# EAGLE schematic 7segDisplay (EAGLE 7.6.0)
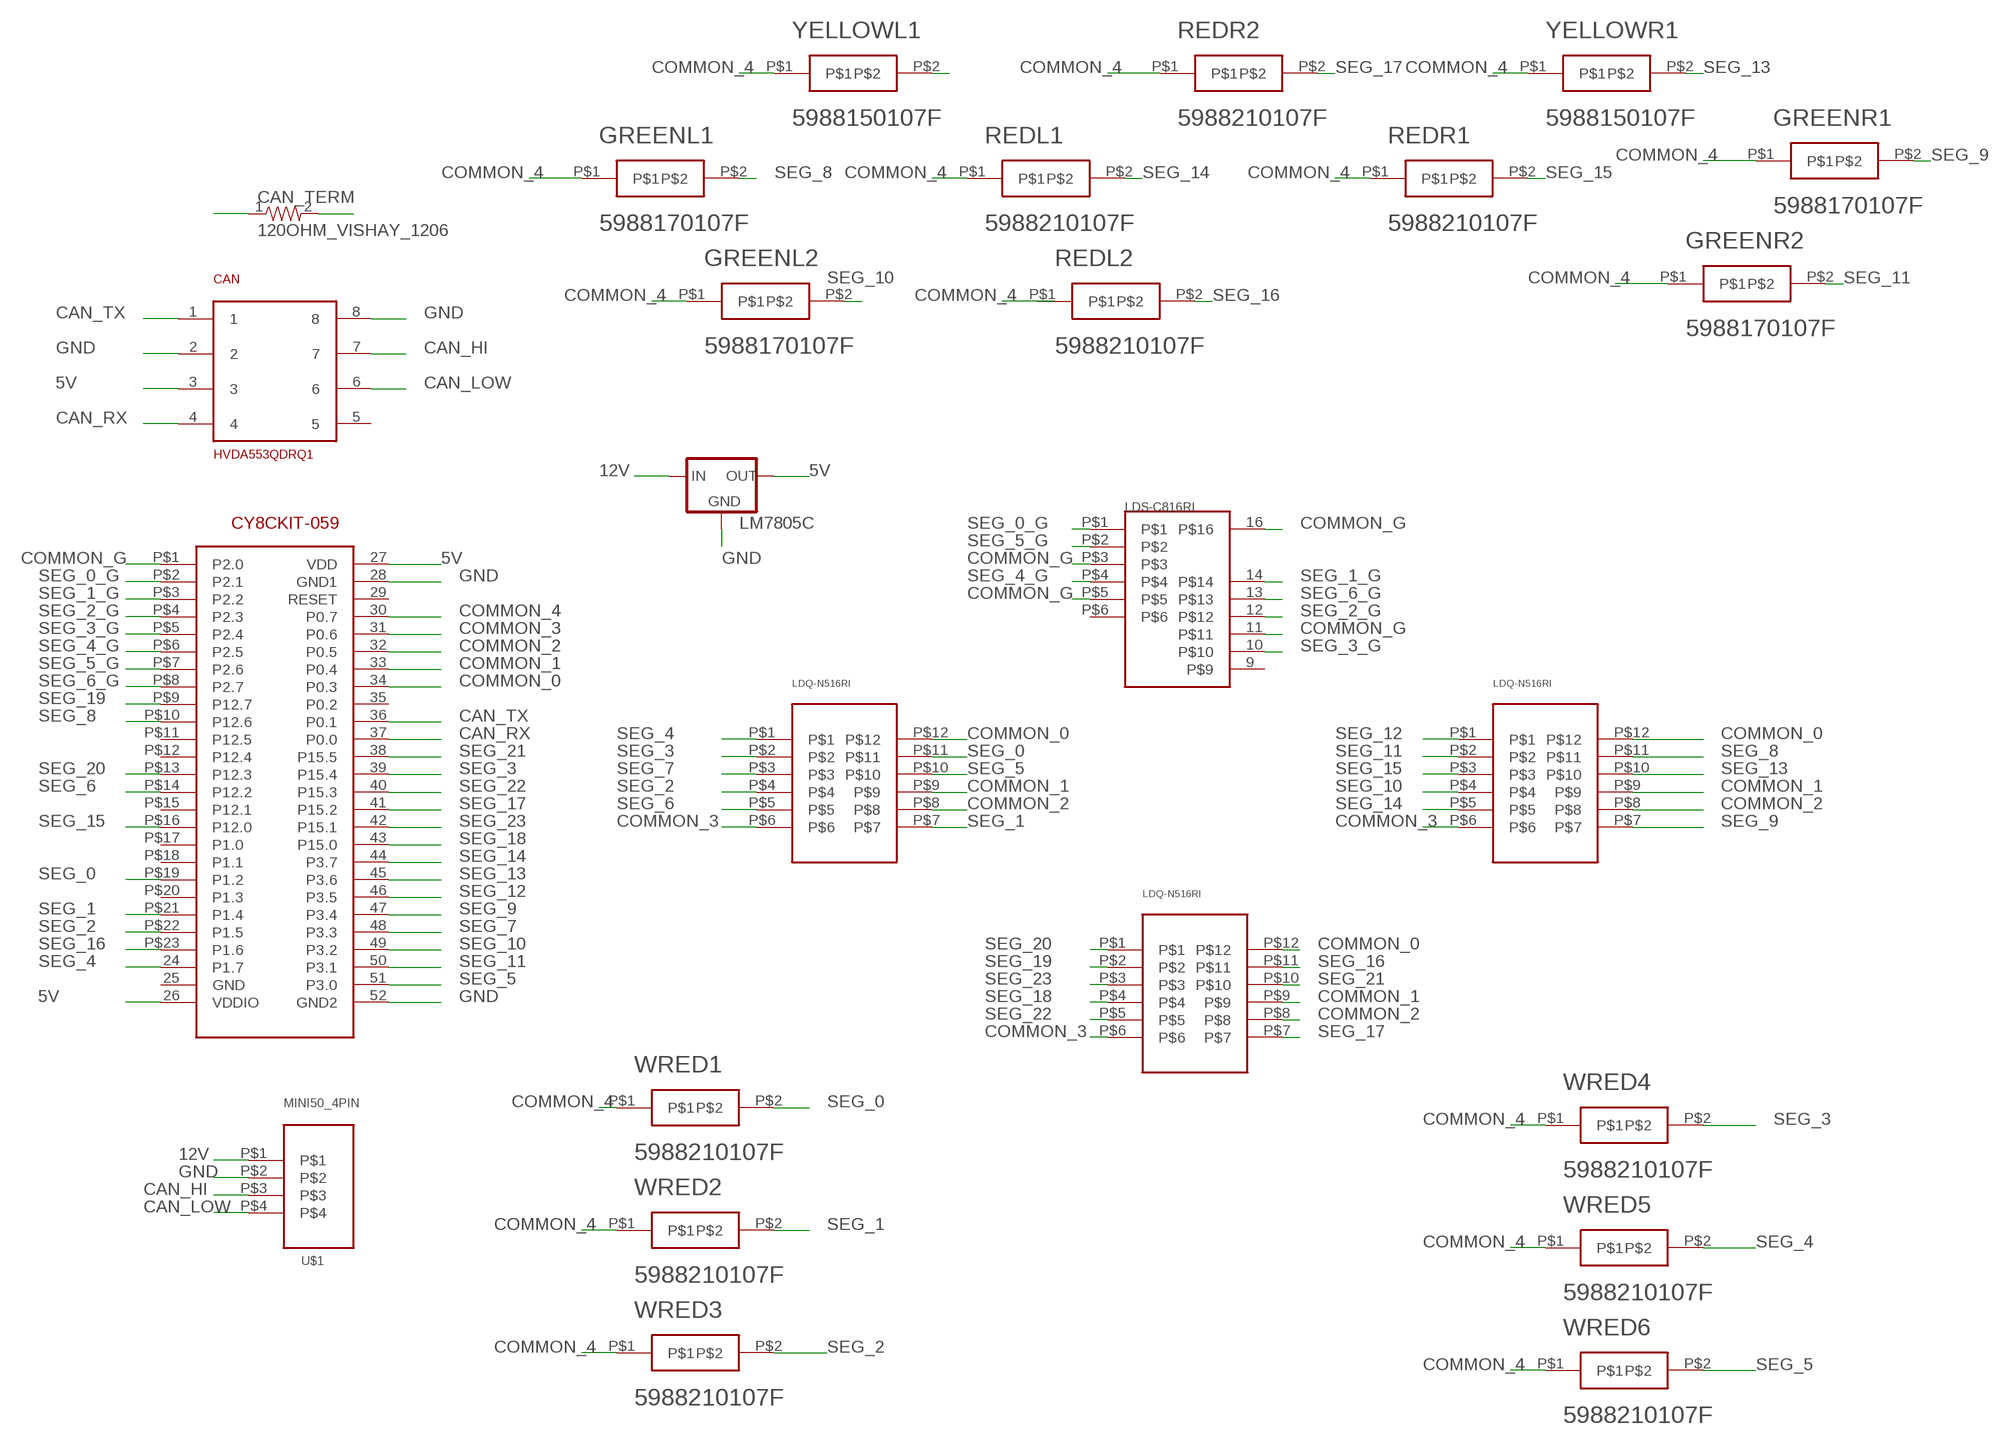
[diagram p0: schematic, sheet 1]

## Parts
BOTTOM  LDQ-N516RI  [LDQ-N516RI]
CAN  HVDA553QDRQ1  [SOIC127P600X172-8N]
CAN_TERM  120OHM_VISHAY_1206  [1206]
GEAR  LDS-C816RITHROUGH_HOLE  [LDS-C816RI]
GREENL1  5988170107F  [0805]
GREENL2  5988170107F  [0805]
GREENR1  5988170107F  [0805]
GREENR2  5988170107F  [0805]
LEFT  LDQ-N516RI  [LDQ-N516RI]
LM7805C  78XXL  [78XXL]
REDL1  5988210107F  [1206]
REDL2  5988210107F  [1206]
REDR1  5988210107F  [1206]
REDR2  5988210107F  [1206]
RIGHT  LDQ-N516RI  [LDQ-N516RI]
U$1  MINI50_4PIN  [34792-0041]
U$3  CY8CKIT-059  [CY8CKIT-059]
WRED1  5988210107F  [1206]
WRED2  5988210107F  [1206]
WRED3  5988210107F  [1206]
WRED4  5988210107F  [1206]
WRED5  5988210107F  [1206]
WRED6  5988210107F  [1206]
YELLOWL1  5988150107F  [0805]
YELLOWR1  5988150107F  [0805]

## Nets
5V: CAN.3 LM7805C.OUT U$3.26(VDDIO) U$3.27(VDD)
12V: LM7805C.IN U$1.P$1
CAN_HI: CAN.7 CAN_TERM.1 U$1.P$3
CAN_LOW: CAN.6 CAN_TERM.2 U$1.P$4
CAN_RX: CAN.4 U$3.37(P0.0)
CAN_TX: CAN.1 U$3.36(P0.1)
COMMON_0: BOTTOM.P$12 LEFT.P$12 RIGHT.P$12 U$3.34(P0.3)
COMMON_1: BOTTOM.P$9 LEFT.P$9 RIGHT.P$9 U$3.33(P0.4)
COMMON_2: BOTTOM.P$8 LEFT.P$8 RIGHT.P$8 U$3.32(P0.5)
COMMON_3: BOTTOM.P$6 LEFT.P$6 RIGHT.P$6 U$3.31(P0.6)
COMMON_4: GREENL1.P$1 GREENL2.P$1 GREENR1.P$1 GREENR2.P$1 REDL1.P$1 REDR1.P$1 REDR2.P$1 U$3.30(P0.7) WRED1.P$1 WRED2.P$1 WRED3.P$1 WRED4.P$1 WRED5.P$1 WRED6.P$1 YELLOWL1.P$1 YELLOWR1.P$1
COMMON_G: GEAR.11 GEAR.16 GEAR.P$3 GEAR.P$5 U$3.P$1(P2.0)
GND: CAN.2 CAN.8 LM7805C.GND U$1.P$2 U$3.28(GND1) U$3.52(GND2)
SEG_0: LEFT.P$11 U$3.P$19(P1.2) WRED1.P$2
SEG_0_G: GEAR.P$1 U$3.P$2(P2.1)
SEG_1: LEFT.P$7 U$3.P$21(P1.4) WRED2.P$2
SEG_1_G: GEAR.14 U$3.P$3(P2.2)
SEG_2: LEFT.P$4 U$3.P$22(P1.5) WRED3.P$2
SEG_2_G: GEAR.12 U$3.P$4(P2.3)
SEG_3: LEFT.P$2 U$3.39(P15.4) WRED4.P$2
SEG_3_G: GEAR.10 U$3.P$5(P2.4)
SEG_4: LEFT.P$1 U$3.24(P1.7) WRED5.P$2
SEG_4_G: GEAR.P$4 U$3.P$6(P2.5)
SEG_5: LEFT.P$10 U$3.51(P3.0) WRED6.P$2
SEG_5_G: GEAR.P$2 U$3.P$7(P2.6)
SEG_6: LEFT.P$5 U$3.P$14(P12.2)
SEG_6_G: GEAR.13 U$3.P$8(P2.7)
SEG_7: LEFT.P$3 U$3.48(P3.3)
SEG_8: GREENL1.P$2 RIGHT.P$11 U$3.P$10(P12.6)
SEG_9: GREENR1.P$2 RIGHT.P$7 U$3.47(P3.4)
SEG_10: GREENL2.P$2 RIGHT.P$4 U$3.49(P3.2)
SEG_11: GREENR2.P$2 RIGHT.P$2 U$3.50(P3.1)
SEG_12: RIGHT.P$1 U$3.46(P3.5) YELLOWL1.P$2
SEG_13: RIGHT.P$10 U$3.45(P3.6) YELLOWR1.P$2
SEG_14: REDL1.P$2 RIGHT.P$5 U$3.44(P3.7)
SEG_15: REDR1.P$2 RIGHT.P$3 U$3.P$16(P12.0)
SEG_16: BOTTOM.P$11 REDL2.P$2 U$3.P$23(P1.6)
SEG_17: BOTTOM.P$7 REDR2.P$2 U$3.41(P15.2)
SEG_18: BOTTOM.P$4 U$3.43(P15.0)
SEG_19: BOTTOM.P$2 U$3.P$9(P12.7)
SEG_20: BOTTOM.P$1 U$3.P$13(P12.3)
SEG_21: BOTTOM.P$10 U$3.38(P15.5)
SEG_22: BOTTOM.P$5 U$3.40(P15.3)
SEG_23: BOTTOM.P$3 U$3.42(P15.1)
Unconnected: CAN.5 GEAR.9 GEAR.P$6 REDL2.P$1 U$3.25(GND) U$3.29(RESET) U$3.35(P0.2) U$3.P$11(P12.5) U$3.P$12(P12.4) U$3.P$15(P12.1) U$3.P$17(P1.0) U$3.P$18(P1.1) U$3.P$20(P1.3)

## Library data of the parts
BOTTOM LEFT RIGHT = 7SegDisp:LDQ-N516RI
CAN = Texas Instruments_By_element14_Batch_1:HVDA553QDRQ1: CAN Transceiver
CAN_TERM = SparkFun-Resistors:120OHM_VISHAY_1206
GEAR = 7SegDisp:LDS-C816RI
GREENL1 GREENL2 GREENR1 GREENR2 = Dialight_By_element14_Batch_1:5988170107F
LM7805C = v-reg:78XXL: VOLTAGE REGULATOR
REDL1 REDL2 REDR1 REDR2 WRED1-WRED6 = Dialight_By_element14_Batch_1:5988210107F
U$1 = Mini50_Connector:MINI50_4PIN
U$3 = CY8CKIT-059:CY8CKIT-059: PSOC 5lp DEV board with programmer broken off
YELLOWL1 YELLOWR1 = Dialight_By_element14_Batch_1:5988150107F